# Altium schematic sheet Sheet1.schdoc
size A
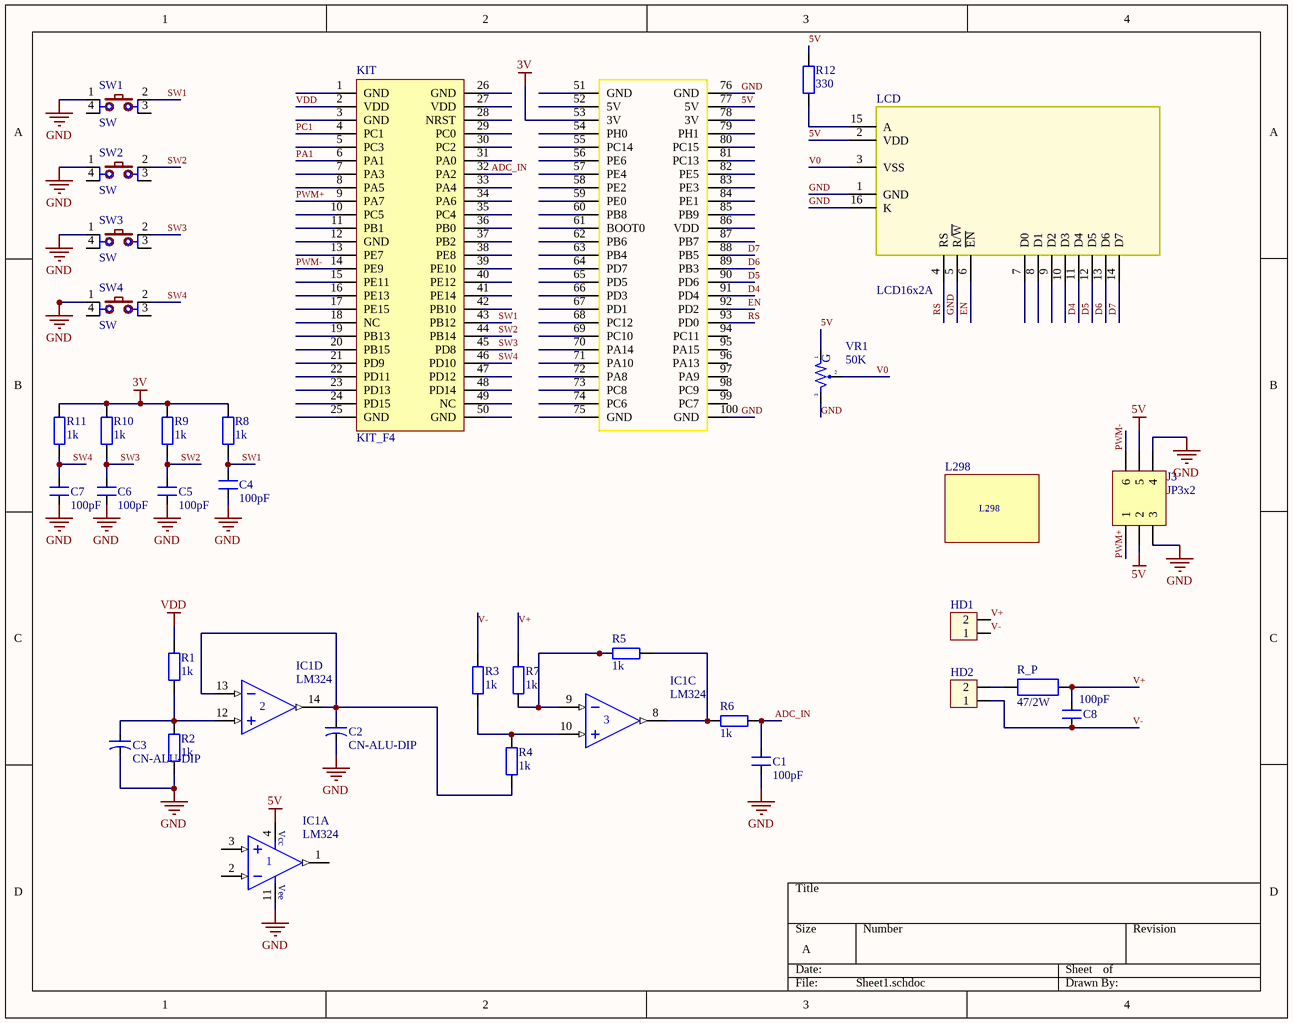
[diagram p0: Sheet1.schdoc]

## Parts
C1  100pF  [CN1]
C2  CN-ALU-DIP  [CA-ALU-2.54]
C3  CN-ALU-DIP  [CA-ALU-2.54]
C4  100pF  [CN1]
C5  100pF  [CN1]
C6  100pF  [CN1]
C7  100pF  [CN1]
C8  100pF  [CN1]
HD1  Header 2  [HED2]  (value not drawn)
HD2  Header 2  [HED2]  (value not drawn)
IC1  LM324  [DIP14/W0.3]  (parts A,C,D of 4)
J3  JP3x2  [JP3-D2T]
KIT  KIT_F4  [Kit-F4]
L298  L298  [L298]  (value not drawn)
LCD  LCD16x2A  [LCD16X2]
R1  1k  [R1/4W]
R2  1k  [R1/4W]
R3  1k  [R1/4W]
R4  1k  [R1/4W]
R5  1k  [R1/4W]
R6  1k  [R1/4W]
R7  1k  [R1/4W]
R8  1k  [R1/4W]
R9  1k  [R1/4W]
R10  1k  [R1/4W]
R11  1k  [R1/4W]
R12  330  [R1/4W]
R_P  47/2W  [R2WD]
SW1  SW  [SW2-DIP]
SW2  SW  [SW2-DIP]
SW3  SW  [SW2-DIP]
SW4  SW  [SW2-DIP]
VR1  50K  [VR-S2]

## Nets
3V: KIT.53(3V) R8.2 R9.2 R10.2 R11.2
5V: IC1.4(V+) J3.2 J3.5 KIT.77(5V) LCD.2(VDD) R12.2 VR1.1
GND: C1.1 C2.2 C3.2 C4.1 C5.1 C6.1 C7.1 IC1.11(V-) J3.3 J3.4 KIT.76(GND) KIT.100(GND) LCD.1(GND) LCD.5(R/~{W}) LCD.16(K) R2.1 SW1.1 SW2.1 SW3.1 SW4.1 VR1.3
VDD: KIT.2(VDD) R1.2
ADC_IN: C1.2 KIT.32(PA2) R6.1
D4: KIT.91(PD4) LCD.11(D4)
D5: KIT.90(PD6) LCD.12(D5)
D6: KIT.89(PB3) LCD.13(D6)
D7: KIT.88(PB5) LCD.14(D7)
EN: KIT.92(PD2) LCD.6(~{EN})
PA1: KIT.6(PA1)
PC1: KIT.4(PC1)
PWM+: J3.1 KIT.9(PA7)
PWM-: J3.6 KIT.14(PE9)
RS: KIT.93(PD0) LCD.4(RS)
SW1: C4.2 KIT.43(PB12) R8.1 SW1.2
SW2: C5.2 KIT.44(PB14) R9.1 SW2.2
SW3: C6.2 KIT.45(PD8) R10.1 SW3.2
SW4: C7.2 KIT.46(PD10) R11.1 SW4.2
V0: LCD.3(VSS) VR1.2
V+: C8.2 HD1.2 R7.2 R_P.2
V-: C8.1 HD1.1 HD2.1 R3.2
NetC2_1: C2.1 IC1.13(IN-) IC1.14(OUT) R4.1
NetC3_1: C3.1 IC1.12(IN+) R1.1 R2.2
NetHD2_2: HD2.2 R_P.1
NetIC1_8: IC1.8(OUT) R5.1 R6.2
NetIC1_9: IC1.9(IN-) R5.2 R7.1
NetIC1_10: IC1.10(IN+) R3.1 R4.2
NetLCD_15: LCD.15(A) R12.1

Not connected (* = marked no-connect by the designer): IC1 1(OUT) 2(IN-) 3(IN+); KIT 1(GND) 3(GND) 5(PC3) 7(PA3) 8(PA5) 10(PC5) 11(PB1) 12(GND) 13(PE7) 15(PE11) 16(PE13) 17(PE15) 18(NC) 19(PB13) 20(PB15) 21(PD9) 22(PD11) 23(PD13) 24(PD15) 25(GND) 26(GND) 27(VDD) 28(NRST) 29(PC0) 30(PC2) 31(PA0) 33(PA4) 34(PA6) 35(PC4) 36(PB0) 37(PB2) 38(PE8) 39(PE10) 40(PE12) 41(PE14) 42(PB10) 47(PD12) 48(PD14) 49(NC) 50(GND) 51(GND) 52(5V) 54(PH0) 55(PC14) 56(PE6) 57(PE4) 58(PE2) 59(PE0) 60(PB8) 61(BOOT0) 62(PB6) 63(PB4) 64(PD7) 65(PD5) 66(PD3) 67(PD1) 68(PC12) 69(PC10) 70(PA14) 71(PA10) 72(PA8) 73(PC8) 74(PC6) 75(GND) 78(3V) 79(PH1) 80(PC15) 81(PC13) 82(PE5) 83(PE3) 84(PE1) 85(PB9) 86(VDD) 87(PB7) 94(PC11) 95(PA15) 96(PA13) 97(PA9) 98(PC9) 99(PC7); LCD 7(D0) 8(D1) 9(D2) 10(D3); SW1 3 4; SW2 3 4; SW3 3 4; SW4 3 4

## Notes on the sheet
- (in symbol LM324, part A) Vcc; Vee
- (in symbol VR-S) G

## Library data of the parts
C1 C4-C8 = CN1: Cap np  1pF - 472pF; Value: 100pF
C2 C3 = CN-ALU-DIP: Capacitor (Semiconductor SIM Model); Value: 104; LatestRevisionDate: 17-Jul-2002; LatestRevisionNote: Re-released for DXP Platform.; PackageReference: C1206; Publisher: Altium Limited
HD1 HD2 = Hed2: Header 2 (Green); Value: Header 2
IC1 = LM324: Op x 4; Value: LM324
J3 = JP3x2: WR-PHD 2.54 mm Dual Socket Header; Manufacturer: W¨¹rth Elektronik eiSos GmbH; partNo: 61300621821; ComponentLink1 Description: Manufacturer; ComponentLink2 Description: Datasheet; NoPins: 06; Created Date: 29 March 2013; ComponentLink1URL: http://www.we-online.com; ComponentLink2URL: http://katalog.we-online.de/em/datasheet/6130xx21821.pdf; Created by: Karrer Zheng
LCD = LCD16x2: LCD dipslay 16 char, 2 line; Value: LCD16x2A
R1-R12 = R1/4W: Resistor 1/4W; Value: R1/4W - 1K
R_P = R2W: Resistor 2W; Value: R2W - 47
SW1-SW4 = SW4: Switch button 4 pin; Value: Button chip 4 pin
VR1 = VR-S: Var Resistor; Value: Volume 50k